# Altium project Tracker_v1_1.PrjPCB (part 1 of 2)
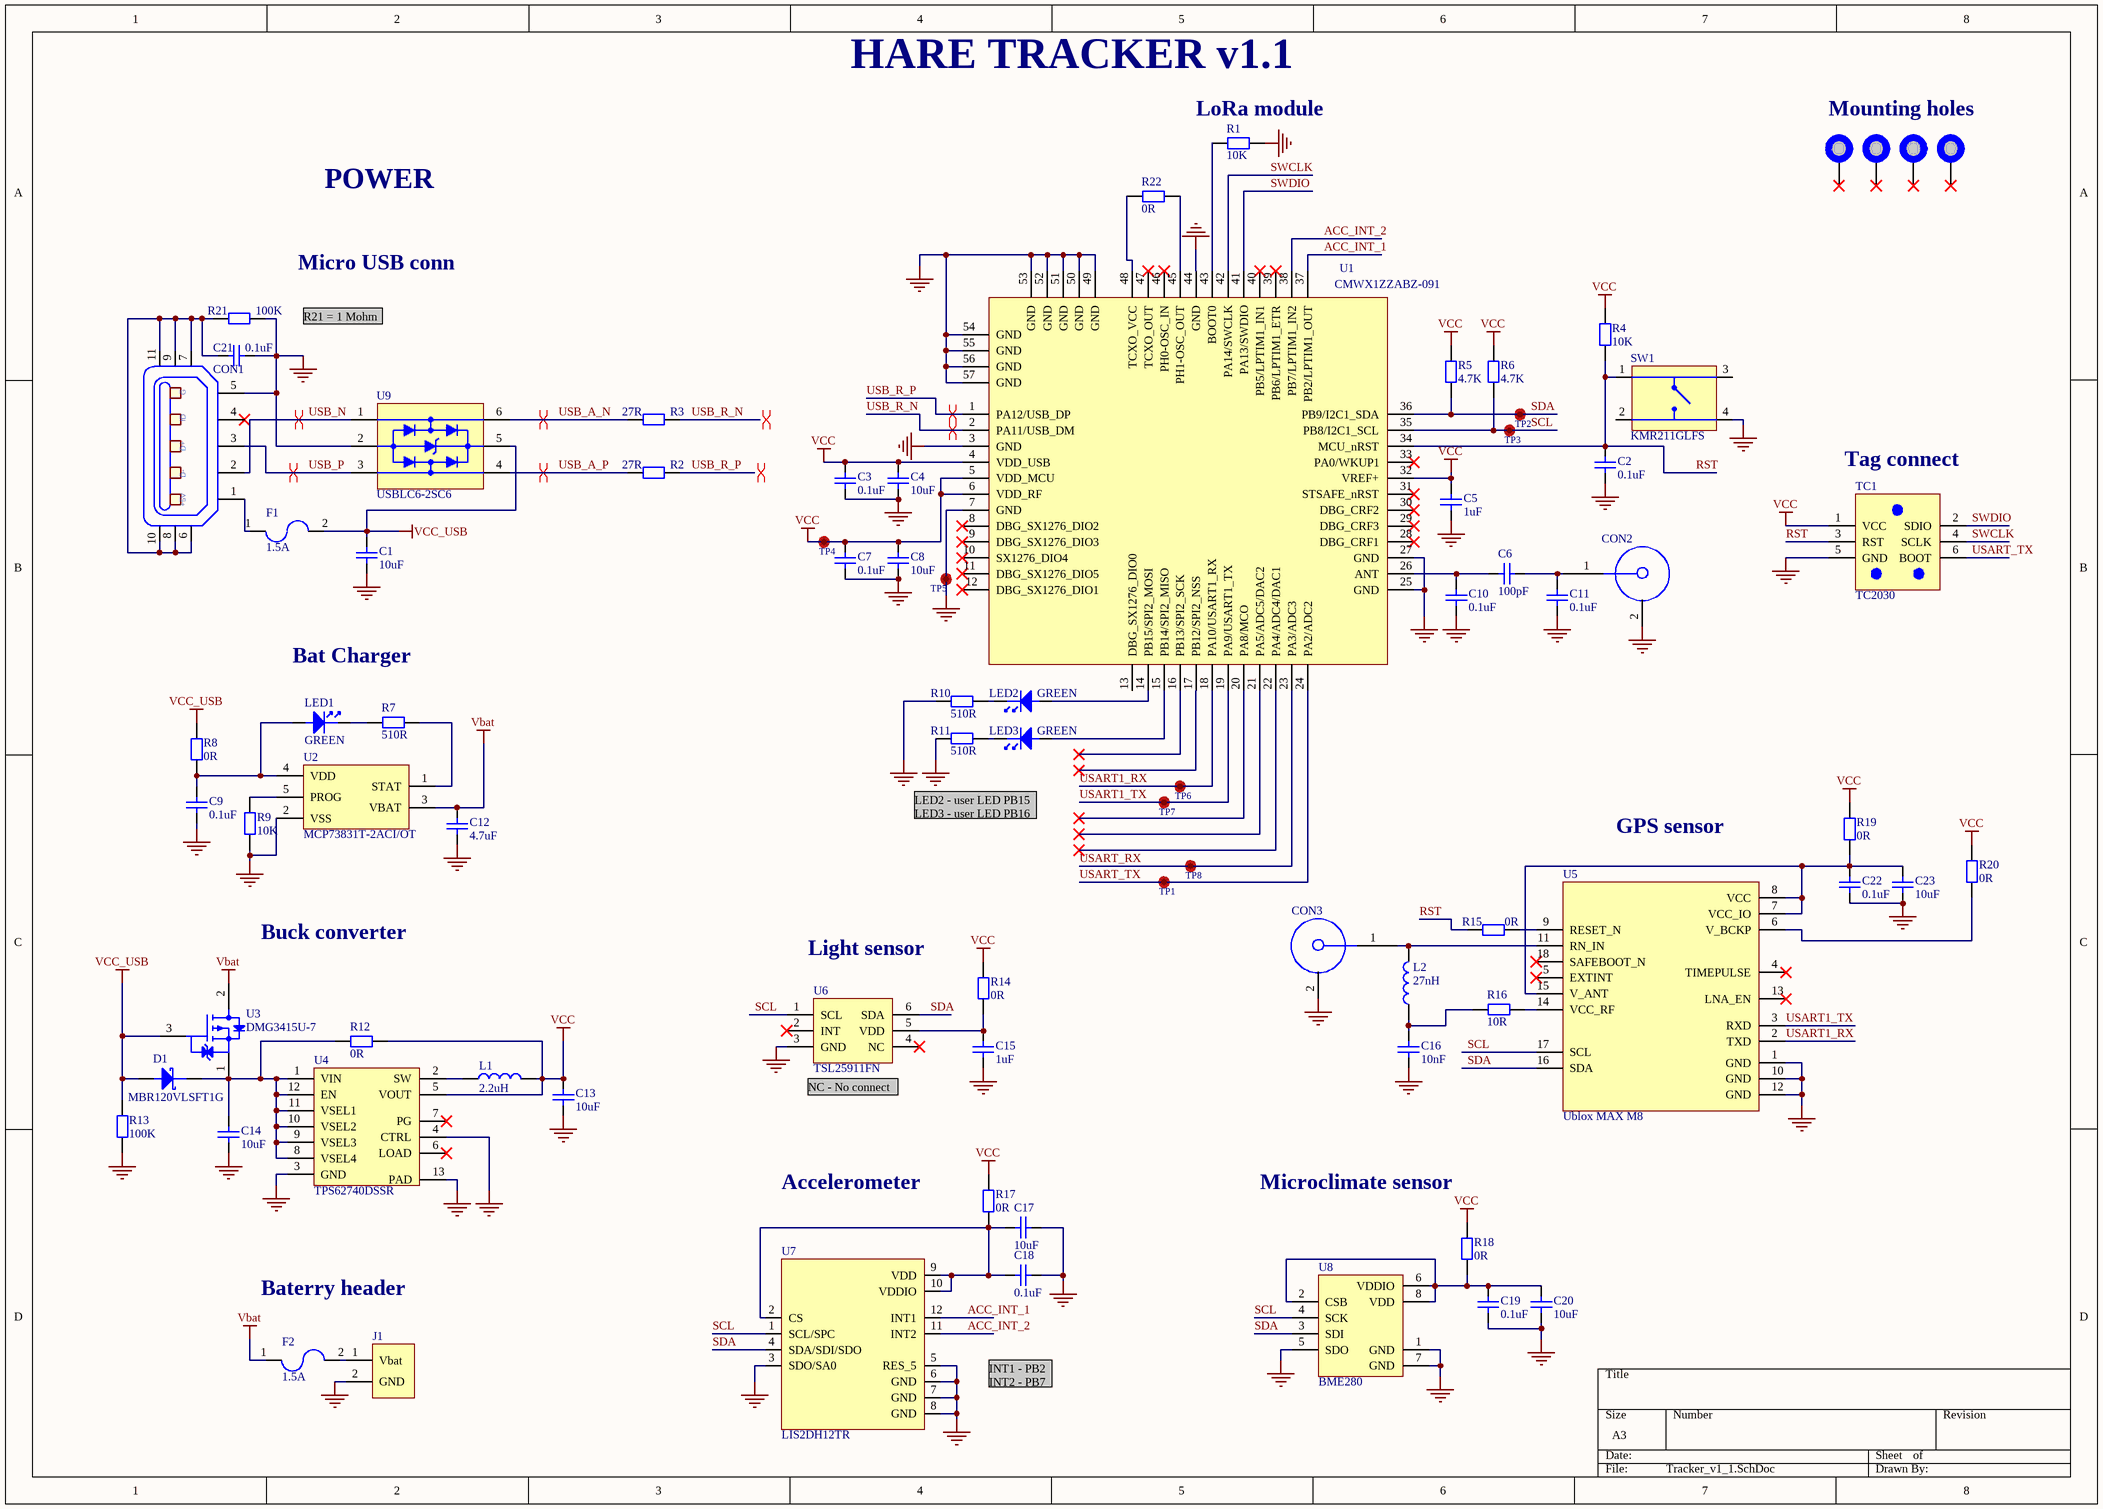
[diagram p0: Tracker_v1_1.SchDoc]
1 sheet, 80 parts. Net scope: global (net labels, ports and power ports of the same name join across sheets).
Board files: Tracker_v1_1_small.PcbDoc, Tracker_v1_1.PcbDoc, Tracker_v1_1_small_1.PcbDoc

## Sheet Tracker_v1_1.SchDoc
size A3

### Parts
C1  10uF  [C0603]
C2  0.1uF  [C0603]
C3  0.1uF  [C0603]
C4  10uF  [C0603]
C5  1uF  [C0603]
C6  100pF  [C0603]
C7  0.1uF  [C0603]
C8  10uF  [C0603]
C9  0.1uF  [C0603]
C10  0.1uF  [C0603]
C11  0.1uF  [C0603]
C12  4.7uF  [C0603]
C13  10uF  [C0603]
C14  10uF  [C0603]
C15  1uF  [C0603]
C16  10nF  [C0603]
C17  10uF  [C0603]
C18  0.1uF  [C0603]
C19  0.1uF  [C0603]
C20  10uF  [C0603]
C21  0.1uF  [C0603]
C22  0.1uF  [C0603]
C23  10uF  [C0603]
CON1  Micro USB SMD  [MICRO usb conn]  (value not drawn)
CON2  73412-0110  [Antena connector]  (value not drawn)
CON3  73412-0110  [Antena connector]  (value not drawn)
D1  MBR120VLSFT1G  [MBR120VLSFT1G]
F1  1.5A  [Fuse]
F2  1.5A  [Fuse]
J1  HDR 1X2  [HEADER 2X1]  (value not drawn)
L1  2.2uH  [L0603]
L2  27nH  [L0603]
LED1  GREEN  [LED_0603]
LED2  GREEN  [LED_0603]
LED3  GREEN  [LED_0603]
MH1  MH_7.4MM_3.2MM_NP  [MH_NC]  (value not drawn)
MH2  MH_7.4MM_3.2MM_NP  [MH_NC]  (value not drawn)
MH3  MH_7.4MM_3.2MM_NP  [MH_NC]  (value not drawn)
MH4  MH_7.4MM_3.2MM_NP  [MH_NC]  (value not drawn)
R1  10K  [R0603]
R2  27R  [R0603]
R3  27R  [R0603]
R4  10K  [R0603]
R5  4.7K  [R0603]
R6  4.7K  [R0603]
R7  510R  [R0603]
R8  0R  [R0603]
R9  10K  [R0603]
R10  510R  [R0603]
R11  510R  [R0603]
R12  0R  [R0603]
R13  100K  [R0603]
R14  0R  [R0603]
R15  0R  [R0603]
R16  10R  [R0603]
R17  0R  [R0603]
R18  0R  [R0603]
R19  0R  [R0603]
R20  0R  [R0603]
R21  100K  [R0603]
R22  0R  [R0603]
SW1  KMR211GLFS  [Button]
TC1  TC2030  [TC2030]
TP1  TestPoint  [TEST POINT 1X1mm]  (value not drawn)
TP2  TestPoint  [TEST POINT 1X1mm]  (value not drawn)
TP3  TestPoint  [TEST POINT 1X1mm]  (value not drawn)
TP4  TestPoint  [TEST POINT 1X1mm]  (value not drawn)
TP5  TestPoint  [TEST POINT 1X1mm]  (value not drawn)
TP6  TestPoint  [TEST POINT 1X1mm]  (value not drawn)
TP7  TestPoint  [TEST POINT 1X1mm]  (value not drawn)
TP8  TestPoint  [TEST POINT 1X1mm]  (value not drawn)
U1  CMWX1ZZABZ-091  [Murata ABZ]
U2  MCP73831T-2ACI/OT  [MCP73831T-2ACI/OT]
U3  DMG3415U-7  [DMG3415U-7]
U4  TPS62740DSSR  [TPS62740DSSR]
U5  Ublox MAX M8  [Ublox MAX M8]
U6  TSL25911FN  [TSL2591]
U7  LIS2DH12TR  [LIS2DH12]
U8  BME280  [BME280]
U9  USBLC6-2SC6  [USBLC6-2SC6]

### Nets
GND: C1.1 C2.1 C3.1 C4.1 C5.1 C7.1 C8.1 C9.1 C10.1 C11.1 C12.1 C13.1 C14.1 C15.1 C16.1 C17.2 C18.2 C19.1 C20.1 C21.2 C22.1 C23.1 CON1.5 CON2.2 CON3.2 J1.2(GND) R1.1 R9.1 R10.1 R11.1 R13.2 R21.2 SW1.4 TC1.5(GND) TP5.0 U1.3(GND) U1.7(GND) U1.25(GND) U1.27(GND) U1.44(GND) U1.49(GND) U1.50(GND) U1.51(GND) U1.52(GND) U1.53(GND) U1.54(GND) U1.55(GND) U1.56(GND) U1.57(GND) U2.2(VSS) U4.3(GND) U4.4(CTRL) U4.13(PAD) U5.1(GND) U5.10(GND) U5.12(GND) U6.3(GND) U7.3(SDO/SA0) U7.5(RES_5) U7.6(GND) U7.7(GND) U7.8(GND) U8.1(GND) U8.5(SDO) U8.7(GND) U9.2
Vbat: C12.2 F2.1 U2.3(VBAT) U3.2(S)
VCC: C3.2 C4.2 C5.2 C7.2 C8.2 C13.2 L1.2 R4.2 R5.2 R6.2 R12.1 R14.2 R17.2 R18.2 R19.1 R20.1 TC1.1(VCC) TP4.0 U1.4(VDD_USB) U1.5(VDD_MCU) U1.6(VDD_RF) U1.32(VREF+) U4.5(VOUT)
VCC_USB: C1.2 D1.2(Anode) F1.2 R8.2 R13.1 U3.3(G) U9.5
ACC_INT_1: U1.37(PB2/LPTIM1_OUT) U7.12(INT1)
ACC_INT_2: U1.38(PB7/LPTIM1_IN2) U7.11(INT2)
RST: C2.2 R4.1 R15.2 SW1.1 TC1.3(RST) U1.34(MCU_nRST)
SCL: R6.1 TP3.0 U1.35(PB8/I2C1_SCL) U5.17(SCL) U6.1(SCL) U7.1(SCL/SPC) U8.4(SCK)
SDA: R5.1 TP2.0 U1.36(PB9/I2C1_SDA) U5.16(SDA) U6.6(SDA) U7.4(SDA/SDI/SDO) U8.3(SDI)
SWCLK: TC1.4(SCLK) U1.42(PA14/SWCLK)
SWDIO: TC1.2(SDIO) U1.41(PA13/SWDIO)
USART1_RX: TP6.0 U1.18(PA10/USART1_RX) U5.2(TXD)
USART1_TX: TP7.0 U1.19(PA9/USART1_TX) U5.3(RXD)
USART_RX: TP8.0 U1.23(PA3/ADC3)
USART_TX: TC1.6(BOOT) TP1.0 U1.24(PA2/ADC2)
USB_A_N: R3.1 U9.6
USB_A_P: R2.1 U9.4
USB_N: CON1.2 U9.1
USB_P: CON1.3 U9.3
USB_R_N: R3.2 U1.2(PA11/USB_DM)
USB_R_P: R2.2 U1.1(PA12/USB_DP)
NetC6_1: C6.1 C10.2 U1.26(ANT)
NetC6_2: C6.2 C11.2 CON2.1
NetC9_2: C9.2 LED1.2(Anode) R8.1 U2.4(VDD)
NetC14_2: C14.2 D1.1(Cathode) R12.2 U3.1(D) U4.1(VIN) U4.8(VSEL4) U4.9(VSEL3) U4.10(VSEL2) U4.11(VSEL1) U4.12(EN)
NetC15_2: C15.2 R14.1 U6.5(VDD)
NetC16_2: C16.2 L2.1 R16.1
NetC17_1: C17.1 C18.1 R17.1 U7.2(CS) U7.9(VDD) U7.10(VDDIO)
NetC19_2: C19.2 C20.2 R18.1 U8.2(CSB) U8.6(VDDIO) U8.8(VDD)
NetC21_1: C21.1 CON1.6 CON1.7 CON1.8 CON1.9 CON1.10 CON1.11 R21.1
NetC22_2: C22.2 C23.2 R19.2 U5.7(VCC_IO) U5.8(VCC) U5.15(V_ANT)
NetCON1_1: CON1.1 F1.1
NetCON3_1: CON3.1 L2.2 U5.11(RN_IN)
NetF2_2: F2.2 J1.1(Vbat)
NetL1_1: L1.1 U4.2(SW)
NetLED1_1: LED1.1(Cathode) R7.1
NetLED2_1: LED2.1(Cathode) R10.2
NetLED2_2: LED2.2(Anode) U1.14(PB15/SPI2_MOSI)
NetLED3_1: LED3.1(Cathode) R11.2
NetLED3_2: LED3.2(Anode) U1.15(PB14/SPI2_MISO)
NetR1_2: R1.2 U1.43(BOOT0)
NetR7_2: R7.2 U2.1(STAT)
NetR9_2: R9.2 U2.5(PROG)
NetR15_1: R15.1 U5.9(RESET_N)
NetR16_2: R16.2 U5.14(VCC_RF)
NetR20_2: R20.2 U5.6(V_BCKP)
NetR22_1: R22.1 U1.48(TCXO_VCC)
NetR22_2: R22.2 U1.45(PH1-OSC_OUT)

Not connected (* = marked no-connect by the designer): CON1 4*; MH1 1*; MH2 1*; MH3 1*; MH4 1*; SW1 2 3; U1 8(DBG_SX1276_DIO2)* 9(DBG_SX1276_DIO3)* 10(SX1276_DIO4)* 11(DBG_SX1276_DIO5)* 12(DBG_SX1276_DIO1)* 13(DBG_SX1276_DIO0) 16(PB13/SPI2_SCK)* 17(PB12/SPI2_NSS)* 20(PA8/MCO)* 21(PA5/ADC5/DAC2)* 22(PA4/ADC4/DAC1)* 28(DBG_CRF1)* 29(DBG_CRF3)* 30(DBG_CRF2)* 31(STSAFE_nRST)* 33(PA0/WKUP1)* 39(PB6/LPTIM1_ETR)* 40(PB5/LPTIM1_IN1)* 46(PH0-OSC_IN)* 47(TCXO_OUT)*; U4 6(LOAD)* 7(PG)*; U5 4(TIMEPULSE)* 5(EXTINT)* 13(LNA_EN)* 18(SAFEBOOT_N)*; U6 2(INT)* 4(NC)*

### Layout directives
differential pair: USB_A_N, USB_A_P, USB_N, USB_P, USB_R_N, USB_R_P

### Notes on the sheet
- HARE TRACKER v1.1
- (near R1) LoRa module
- Mounting holes
- POWER
- Micro USB conn
- R21 = 1 Mohm
- (near TC1) Tag connect
- Bat Charger
- LED2 - user LED PB15
  LED3 - user LED PB16
- GPS sensor
- Buck converter
- Light sensor
- (near U6) NC - No connect
- Accelerometer
- (near R18) Microclimate sensor
- Baterry header
- INT1 - PB2
  INT2 - PB7
- (in symbol Micro USB SMD) G; ID; D+; D-; +5V